# Altium schematic sheet 8bit_reg_v1.SchDoc
size OrCAD E; SheetNumber: 1; SheetTotal: 1
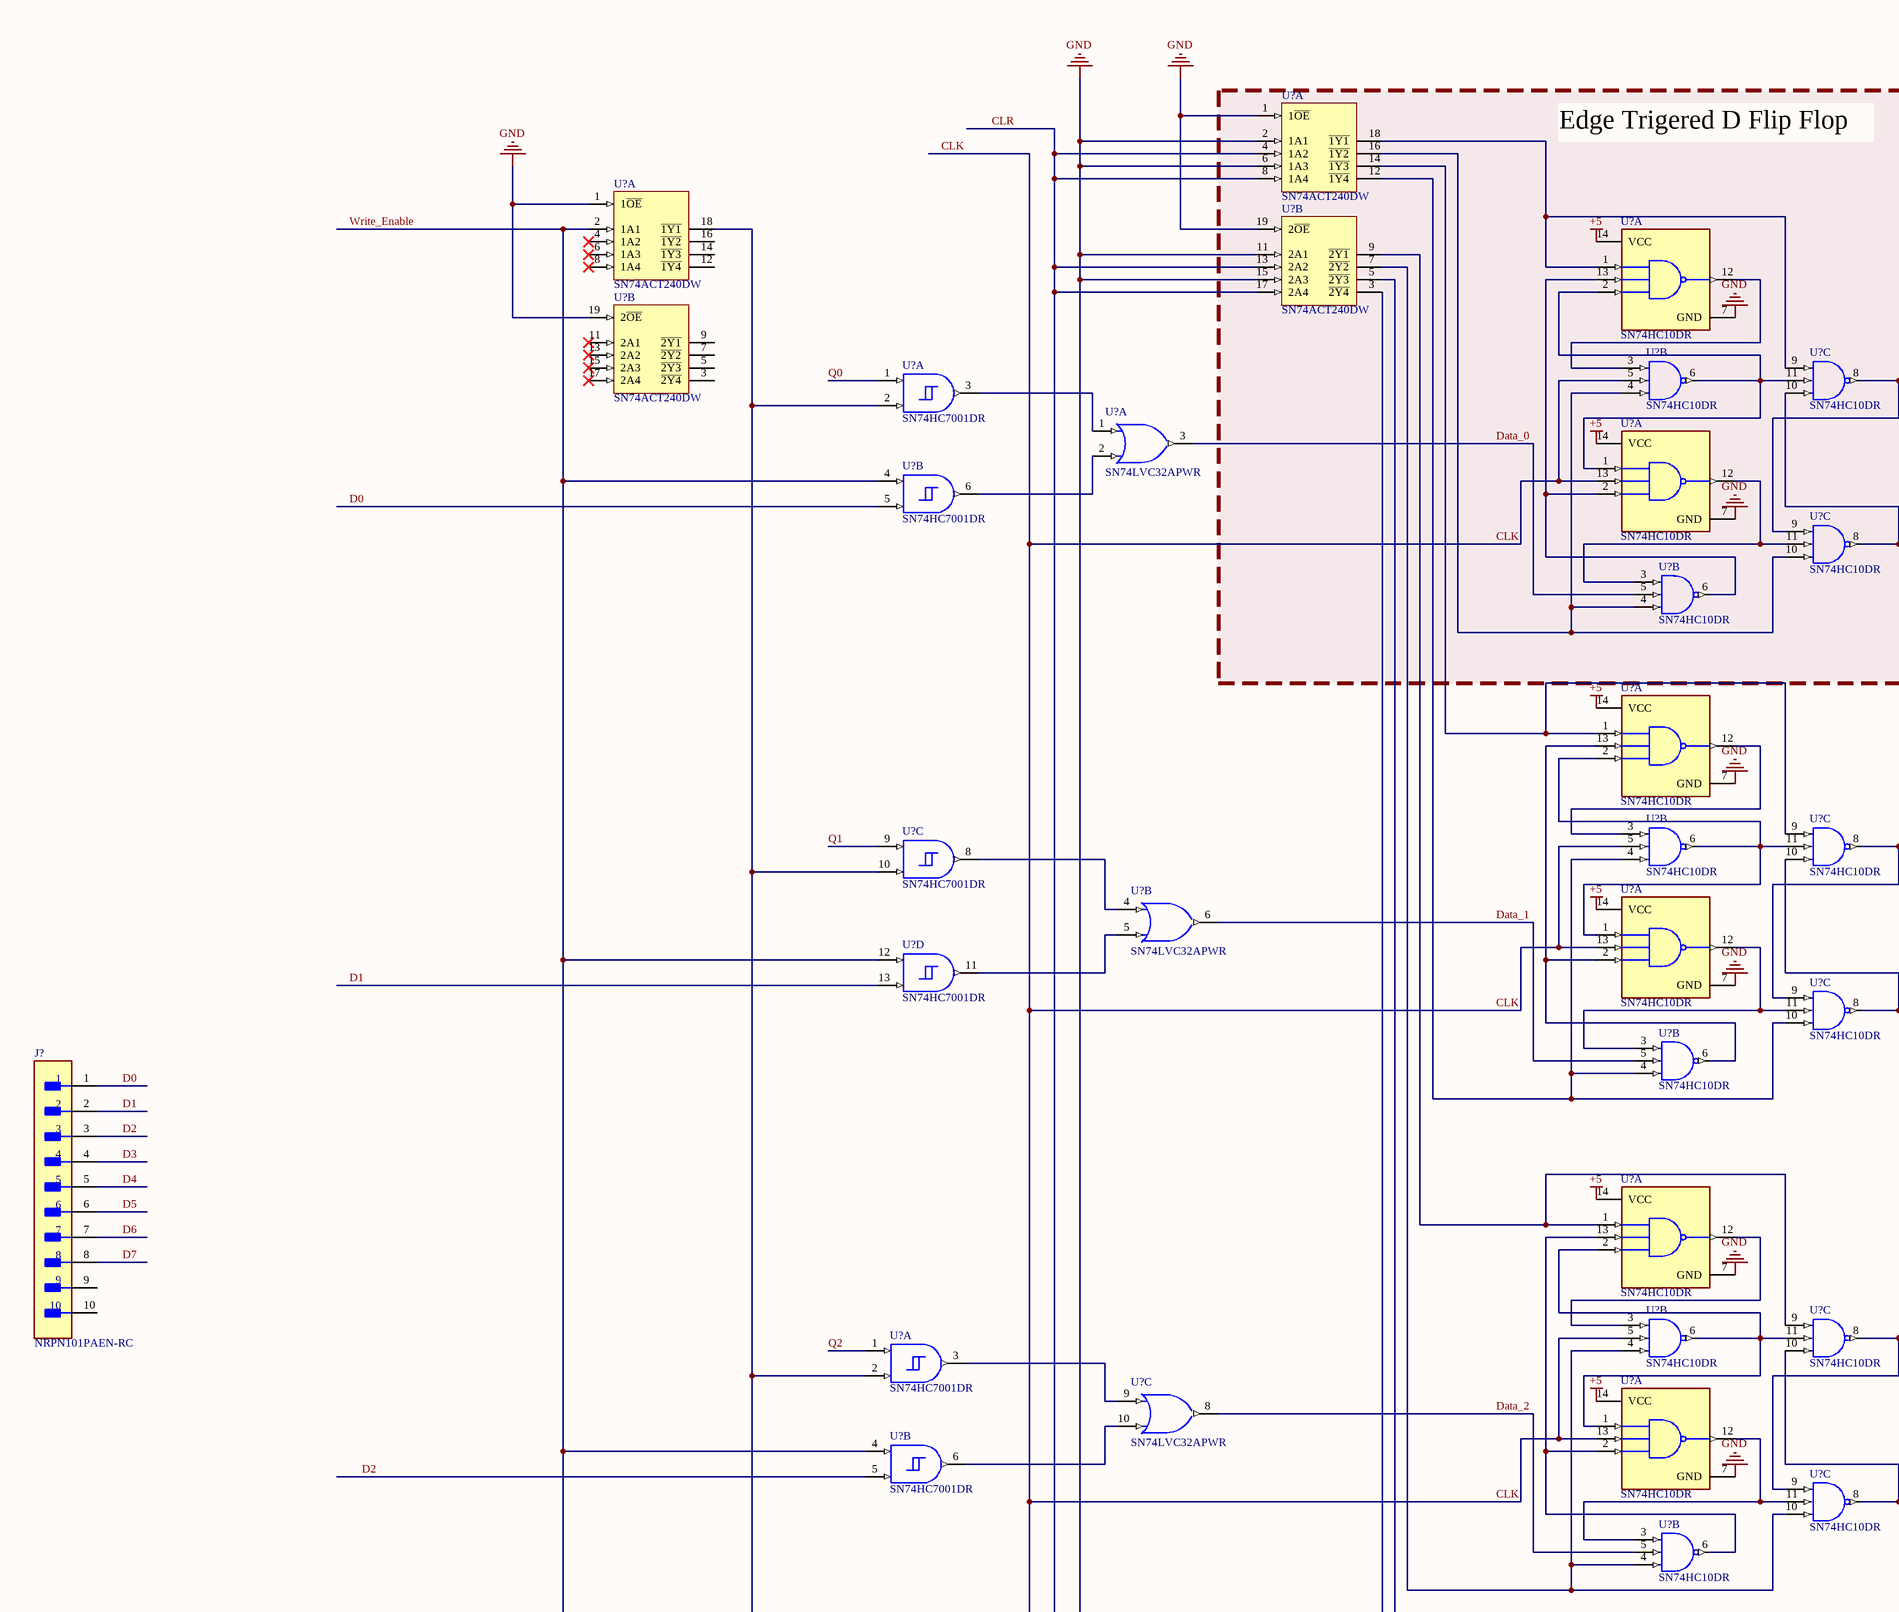
[diagram p0: 8bit_reg_v1.SchDoc, top left]
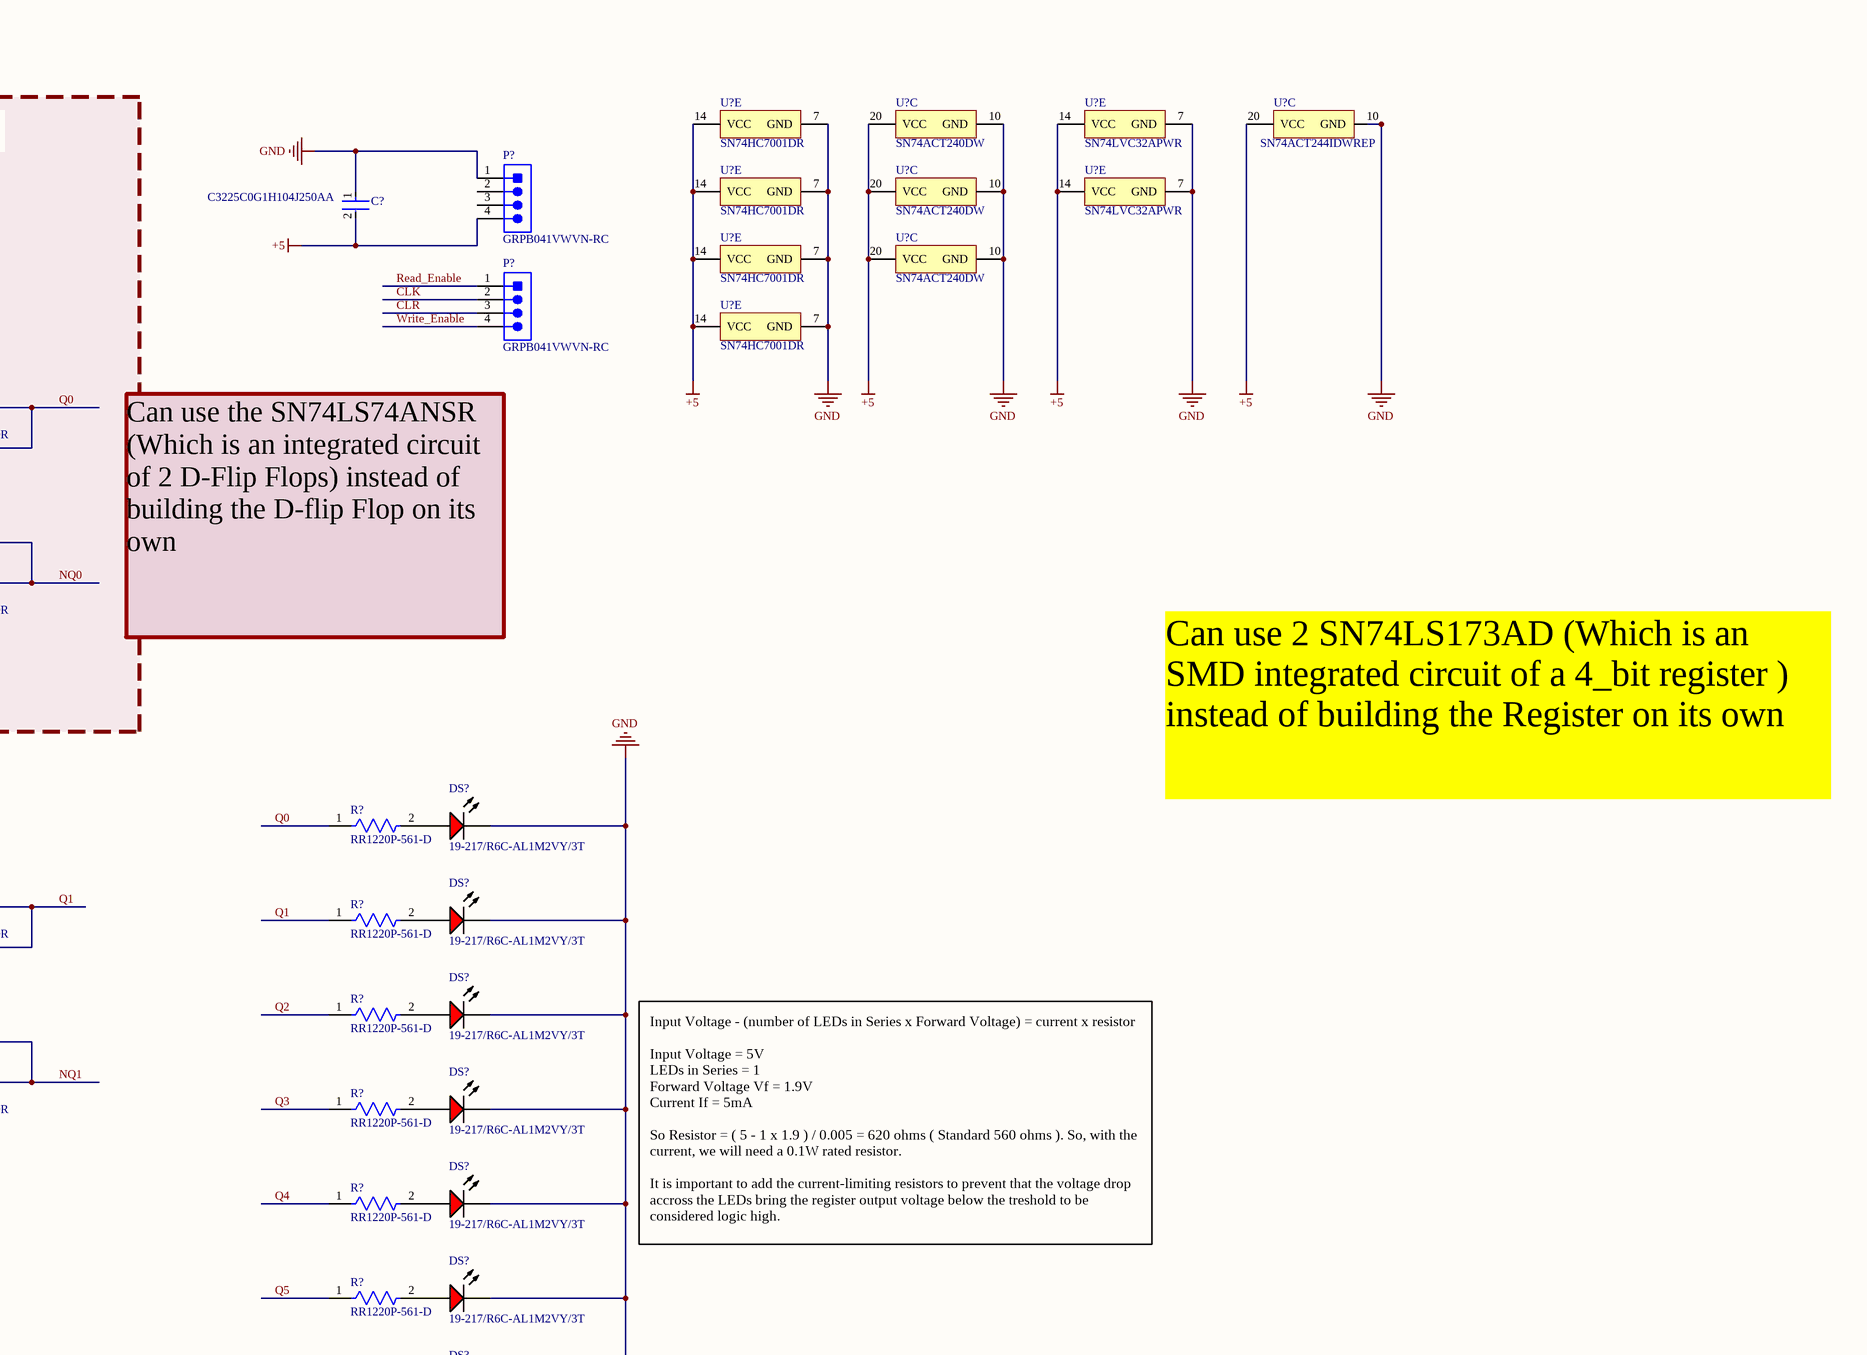
[diagram p1: 8bit_reg_v1.SchDoc, top right]
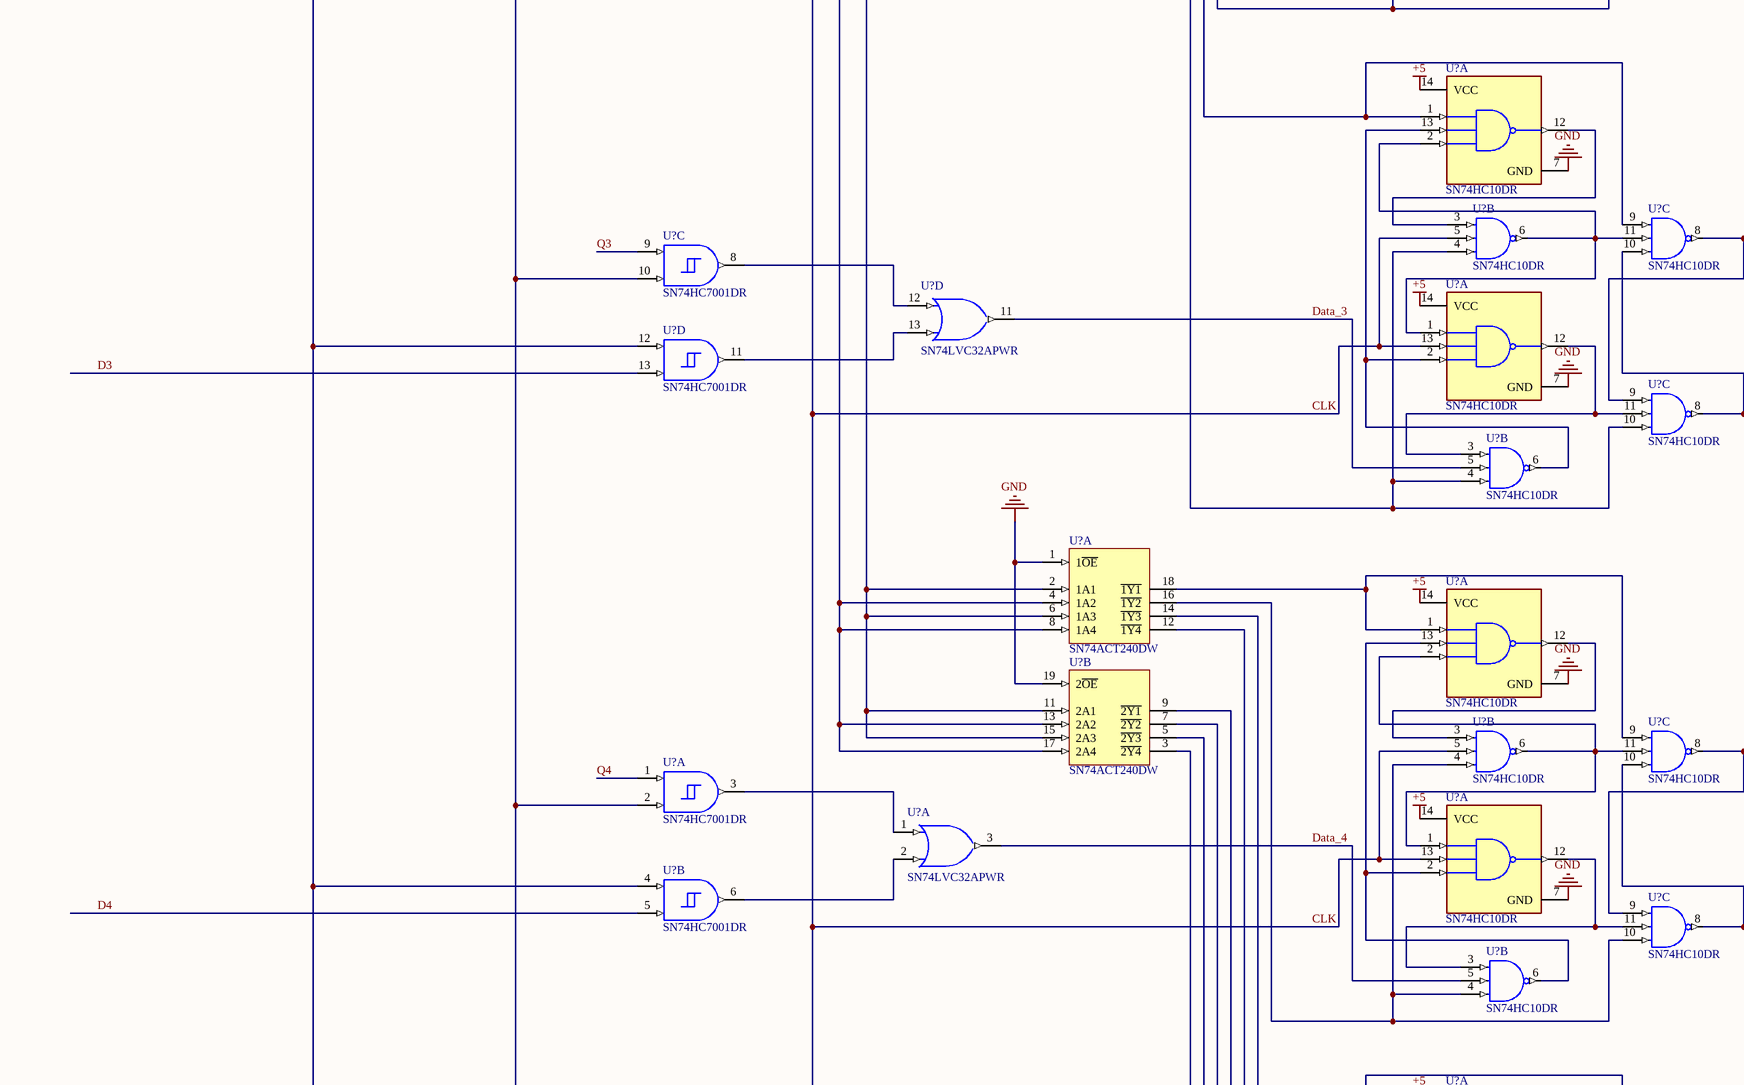
[diagram p2: 8bit_reg_v1.SchDoc, centre left]
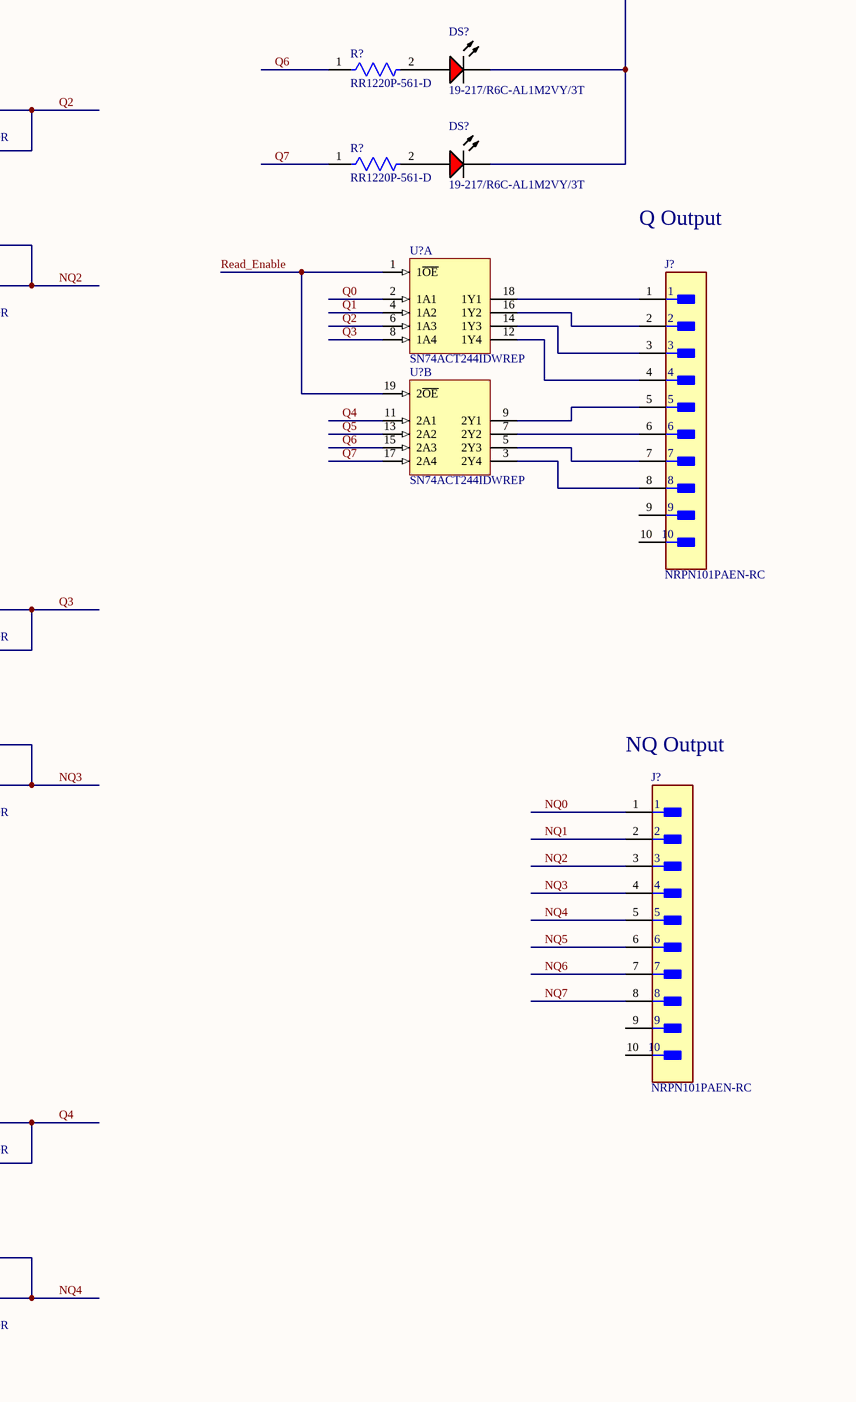
[diagram p3: 8bit_reg_v1.SchDoc, centre right]
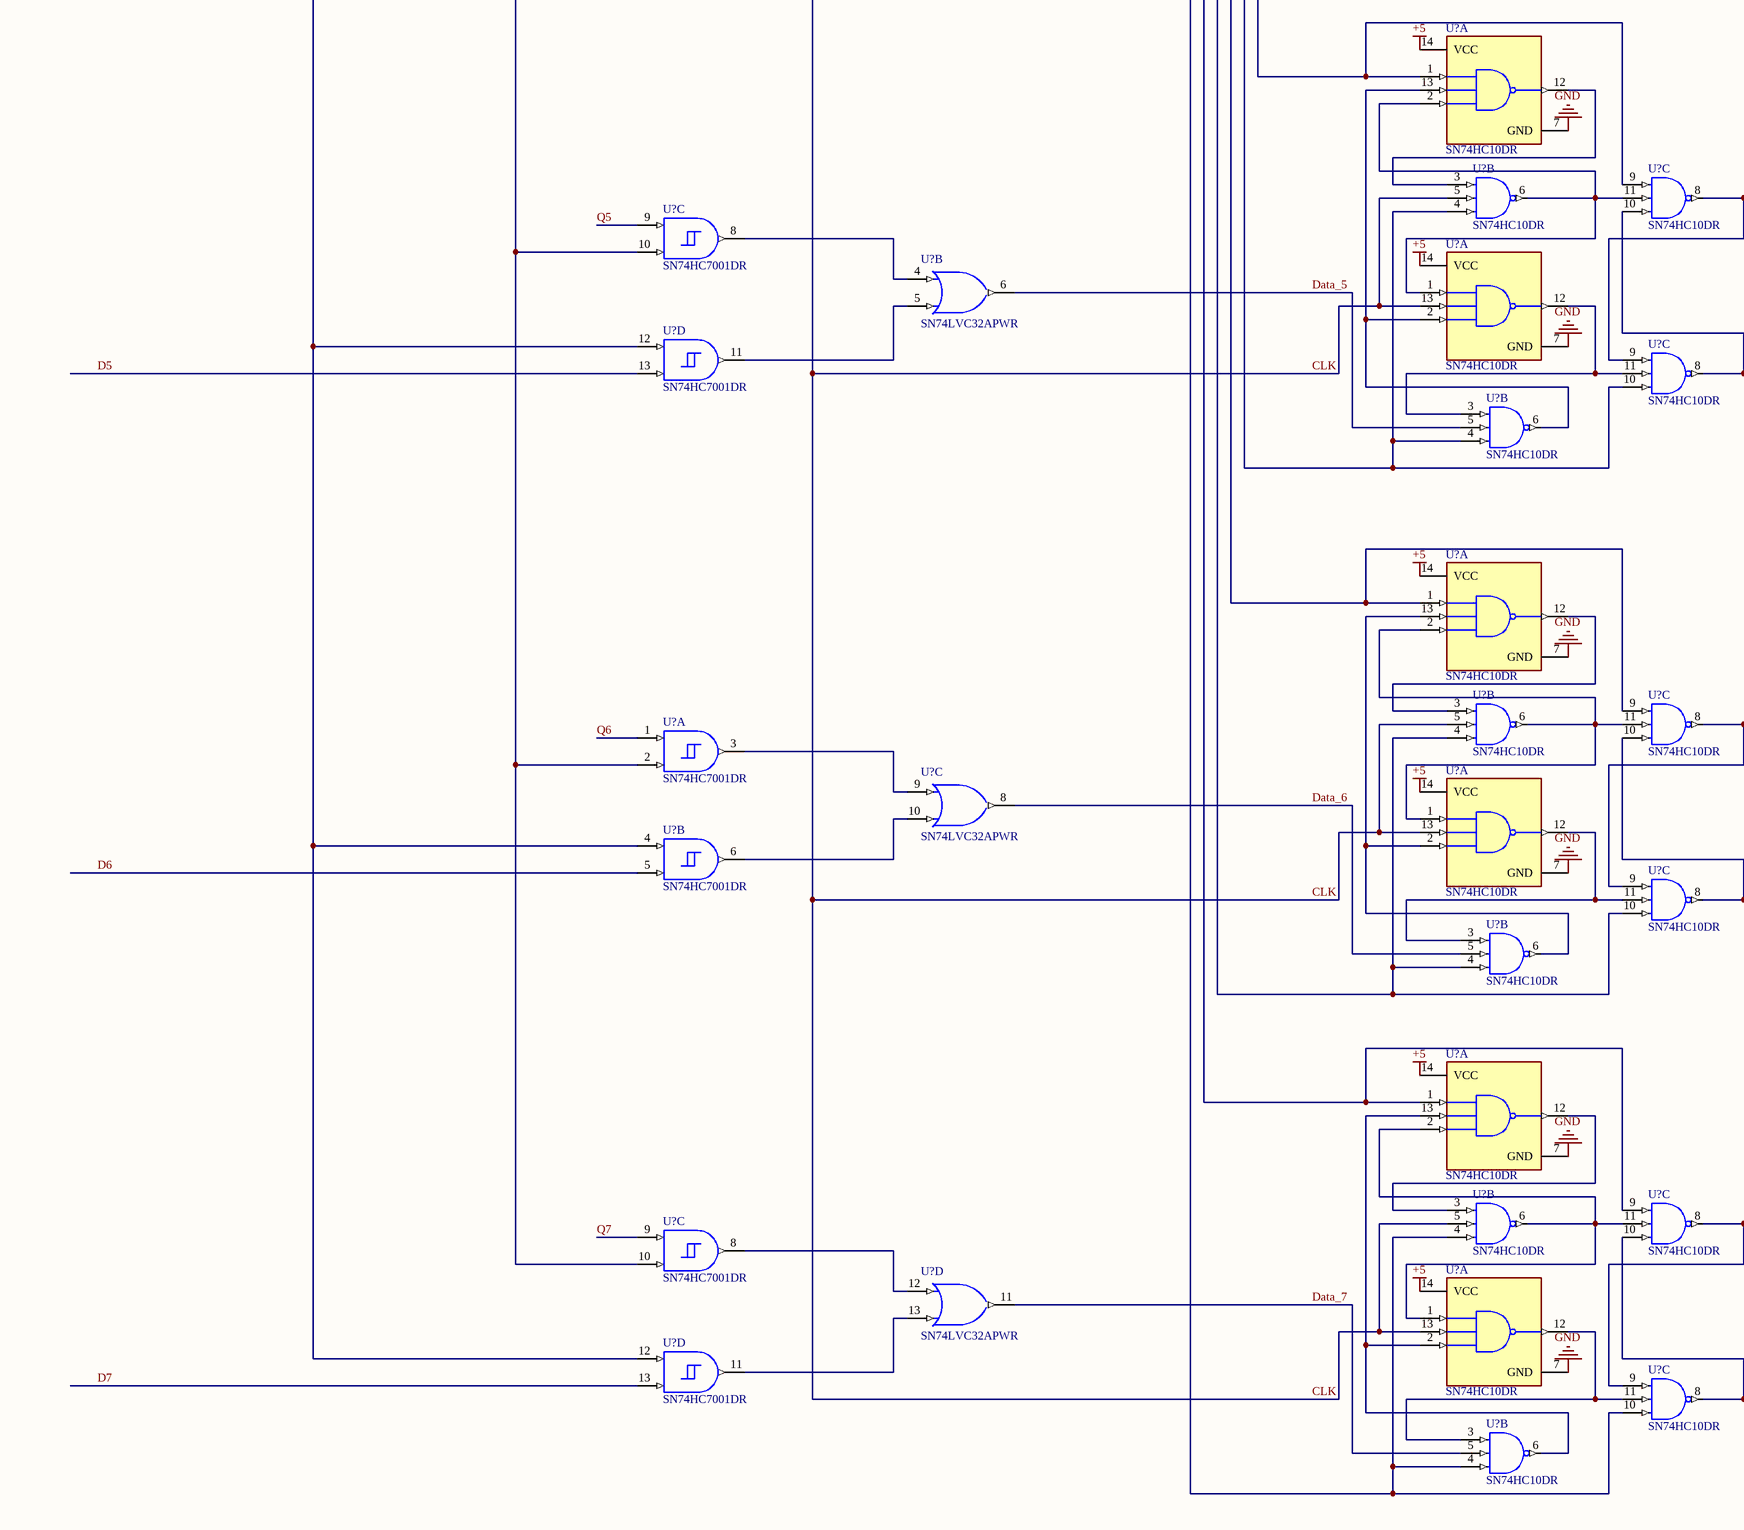
[diagram p4: 8bit_reg_v1.SchDoc, bottom left]
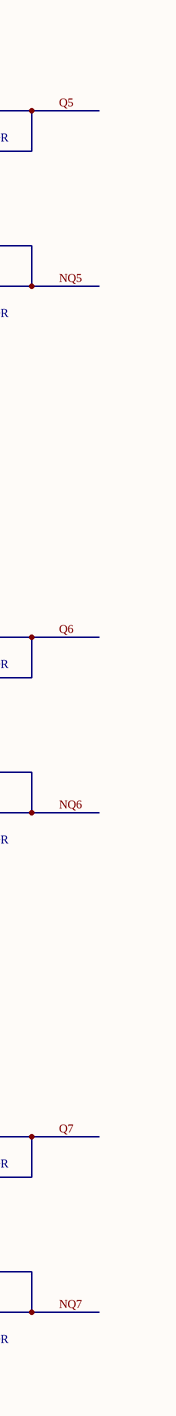
[diagram p5: 8bit_reg_v1.SchDoc, bottom right]

## Parts
(Parts that share a designator on the sheet are numbered #1, #2 ... from top to bottom, then left to right.)
C?  C3225C0G1H104J250AA  [FP-C3225-250-0_4-IPC_A]
DS?#1  19-217/R6C-AL1M2VY/3T  [EVRL-0603-2_V]
DS?#2  19-217/R6C-AL1M2VY/3T  [EVRL-0603-2_V]
DS?#3  19-217/R6C-AL1M2VY/3T  [EVRL-0603-2_V]
DS?#4  19-217/R6C-AL1M2VY/3T  [EVRL-0603-2_V]
DS?#5  19-217/R6C-AL1M2VY/3T  [EVRL-0603-2_V]
DS?#6  19-217/R6C-AL1M2VY/3T  [EVRL-0603-2_V]
DS?#7  19-217/R6C-AL1M2VY/3T  [EVRL-0603-2_V]
DS?#8  19-217/R6C-AL1M2VY/3T  [EVRL-0603-2_V]
J?#1  NRPN101PAEN-RC  [FP-NRPN101PAEN-RC-MFG]
J?#2  NRPN101PAEN-RC  [FP-NRPN101PAEN-RC-MFG]
J?#3  NRPN101PAEN-RC  [FP-NRPN101PAEN-RC-MFG]
P?#1  GRPB041VWVN-RC  [SLIN-GRPB041VWVN-RC_V]
P?#2  GRPB041VWVN-RC  [SLIN-GRPB041VWVN-RC_V]
R?#1  RR1220P-561-D  [FP-RR1220-IPC_C]
R?#2  RR1220P-561-D  [FP-RR1220-IPC_C]
R?#3  RR1220P-561-D  [FP-RR1220-IPC_C]
R?#4  RR1220P-561-D  [FP-RR1220-IPC_C]
R?#5  RR1220P-561-D  [FP-RR1220-IPC_C]
R?#6  RR1220P-561-D  [FP-RR1220-IPC_C]
R?#7  RR1220P-561-D  [FP-RR1220-IPC_C]
R?#8  RR1220P-561-D  [FP-RR1220-IPC_C]
U?#1  SN74ACT240DW  [DW0020A_M]  (part A of 3)
U?#2  SN74HC7001DR  [D0014A_L]  (part E of 5)
U?#3  SN74ACT240DW  [DW0020A_M]  (part C of 3)
U?#4  SN74LVC32APWR  [PW0014A_N]  (part E of 5)
U?#5  SN74ACT244IDWREP  [DW0020A_L]  (part C of 3)
U?#6  SN74HC7001DR  [D0014A_L]  (part E of 5)
U?#7  SN74ACT240DW  [DW0020A_M]  (part C of 3)
U?#8  SN74LVC32APWR  [PW0014A_N]  (part E of 5)
U?#9  SN74ACT240DW  [DW0020A_M]  (part A of 3)
U?#10  SN74ACT240DW  [DW0020A_M]  (part B of 3)
U?#11  SN74HC7001DR  [D0014A_L]  (part E of 5)
U?#12  SN74ACT240DW  [DW0020A_M]  (part C of 3)
U?#13  SN74HC10DR  [FP-D0014A-IPC_B]  (part A of 3)
U?#14  SN74HC7001DR  [D0014A_L]  (part E of 5)
U?#15  SN74ACT240DW  [DW0020A_M]  (part B of 3)
U?#16  SN74HC7001DR  [D0014A_L]  (part A of 5)
U?#17  SN74HC10DR  [FP-D0014A-IPC_B]  (part B of 3)
U?#18  SN74HC10DR  [FP-D0014A-IPC_B]  (part C of 3)
U?#19  SN74LVC32APWR  [PW0014A_N]  (part A of 5)
U?#20  SN74HC10DR  [FP-D0014A-IPC_B]  (part A of 3)
U?#21  SN74HC7001DR  [D0014A_L]  (part B of 5)
U?#22  SN74HC10DR  [FP-D0014A-IPC_B]  (part C of 3)
U?#23  SN74HC10DR  [FP-D0014A-IPC_B]  (part B of 3)
U?#24  SN74HC10DR  [FP-D0014A-IPC_B]  (part A of 3)
U?#25  SN74HC7001DR  [D0014A_L]  (part C of 5)
U?#26  SN74HC10DR  [FP-D0014A-IPC_B]  (part B of 3)
U?#27  SN74HC10DR  [FP-D0014A-IPC_B]  (part C of 3)
U?#28  SN74LVC32APWR  [PW0014A_N]  (part B of 5)
U?#29  SN74HC10DR  [FP-D0014A-IPC_B]  (part A of 3)
U?#30  SN74HC7001DR  [D0014A_L]  (part D of 5)
U?#31  SN74HC10DR  [FP-D0014A-IPC_B]  (part C of 3)
U?#32  SN74HC10DR  [FP-D0014A-IPC_B]  (part B of 3)
U?#33  SN74HC10DR  [FP-D0014A-IPC_B]  (part A of 3)
U?#34  SN74HC10DR  [FP-D0014A-IPC_B]  (part B of 3)
U?#35  SN74HC10DR  [FP-D0014A-IPC_B]  (part C of 3)
U?#36  SN74HC7001DR  [D0014A_L]  (part A of 5)
U?#37  SN74LVC32APWR  [PW0014A_N]  (part C of 5)
U?#38  SN74HC10DR  [FP-D0014A-IPC_B]  (part A of 3)
U?#39  SN74HC7001DR  [D0014A_L]  (part B of 5)
U?#40  SN74ACT244IDWREP  [DW0020A_L]  (part A of 3)
U?#41  SN74HC10DR  [FP-D0014A-IPC_B]  (part C of 3)
U?#42  SN74HC10DR  [FP-D0014A-IPC_B]  (part B of 3)
U?#43  SN74ACT244IDWREP  [DW0020A_L]  (part B of 3)
U?#44  SN74HC10DR  [FP-D0014A-IPC_B]  (part A of 3)
U?#45  SN74HC10DR  [FP-D0014A-IPC_B]  (part B of 3)
U?#46  SN74HC10DR  [FP-D0014A-IPC_B]  (part C of 3)
U?#47  SN74HC7001DR  [D0014A_L]  (part C of 5)
U?#48  SN74LVC32APWR  [PW0014A_N]  (part D of 5)
U?#49  SN74HC10DR  [FP-D0014A-IPC_B]  (part A of 3)
U?#50  SN74HC7001DR  [D0014A_L]  (part D of 5)
U?#51  SN74HC10DR  [FP-D0014A-IPC_B]  (part C of 3)
U?#52  SN74HC10DR  [FP-D0014A-IPC_B]  (part B of 3)
U?#53  SN74ACT240DW  [DW0020A_M]  (part A of 3)
U?#54  SN74HC10DR  [FP-D0014A-IPC_B]  (part A of 3)
U?#55  SN74ACT240DW  [DW0020A_M]  (part B of 3)
U?#56  SN74HC10DR  [FP-D0014A-IPC_B]  (part B of 3)
U?#57  SN74HC10DR  [FP-D0014A-IPC_B]  (part C of 3)
U?#58  SN74HC7001DR  [D0014A_L]  (part A of 5)
U?#59  SN74LVC32APWR  [PW0014A_N]  (part A of 5)
U?#60  SN74HC10DR  [FP-D0014A-IPC_B]  (part A of 3)
U?#61  SN74HC7001DR  [D0014A_L]  (part B of 5)
U?#62  SN74HC10DR  [FP-D0014A-IPC_B]  (part C of 3)
U?#63  SN74HC10DR  [FP-D0014A-IPC_B]  (part B of 3)
U?#64  SN74HC10DR  [FP-D0014A-IPC_B]  (part A of 3)
U?#65  SN74HC10DR  [FP-D0014A-IPC_B]  (part B of 3)
U?#66  SN74HC10DR  [FP-D0014A-IPC_B]  (part C of 3)
U?#67  SN74HC7001DR  [D0014A_L]  (part C of 5)
U?#68  SN74LVC32APWR  [PW0014A_N]  (part B of 5)
U?#69  SN74HC10DR  [FP-D0014A-IPC_B]  (part A of 3)
U?#70  SN74HC7001DR  [D0014A_L]  (part D of 5)
U?#71  SN74HC10DR  [FP-D0014A-IPC_B]  (part C of 3)
U?#72  SN74HC10DR  [FP-D0014A-IPC_B]  (part B of 3)
U?#73  SN74HC10DR  [FP-D0014A-IPC_B]  (part A of 3)
U?#74  SN74HC10DR  [FP-D0014A-IPC_B]  (part B of 3)
U?#75  SN74HC10DR  [FP-D0014A-IPC_B]  (part C of 3)
U?#76  SN74HC7001DR  [D0014A_L]  (part A of 5)
U?#77  SN74LVC32APWR  [PW0014A_N]  (part C of 5)
U?#78  SN74HC10DR  [FP-D0014A-IPC_B]  (part A of 3)
U?#79  SN74HC7001DR  [D0014A_L]  (part B of 5)
U?#80  SN74HC10DR  [FP-D0014A-IPC_B]  (part C of 3)
U?#81  SN74HC10DR  [FP-D0014A-IPC_B]  (part B of 3)
U?#82  SN74HC10DR  [FP-D0014A-IPC_B]  (part A of 3)
U?#83  SN74HC10DR  [FP-D0014A-IPC_B]  (part B of 3)
U?#84  SN74HC10DR  [FP-D0014A-IPC_B]  (part C of 3)
U?#85  SN74HC7001DR  [D0014A_L]  (part C of 5)
U?#86  SN74LVC32APWR  [PW0014A_N]  (part D of 5)
U?#87  SN74HC10DR  [FP-D0014A-IPC_B]  (part A of 3)
U?#88  SN74HC7001DR  [D0014A_L]  (part D of 5)
U?#89  SN74HC10DR  [FP-D0014A-IPC_B]  (part C of 3)
U?#90  SN74HC10DR  [FP-D0014A-IPC_B]  (part B of 3)

## Nets
+5: C?.2 P?#1.4 U?#2.14(VCC) U?#3.20(VCC) U?#4.14(VCC) U?#5.20(VCC) U?#6.14(VCC) U?#7.20(VCC) U?#8.14(VCC) U?#11.14(VCC) U?#12.20(VCC) U?#13.14(VCC) U?#14.14(VCC) U?#20.14(VCC) U?#24.14(VCC) U?#29.14(VCC) U?#33.14(VCC) U?#38.14(VCC) U?#44.14(VCC) U?#49.14(VCC) U?#54.14(VCC) U?#60.14(VCC) U?#64.14(VCC) U?#69.14(VCC) U?#73.14(VCC) U?#78.14(VCC) U?#82.14(VCC) U?#87.14(VCC)
GND: C?.1 DS?#1.2(K) DS?#2.2(K) DS?#3.2(K) DS?#4.2(K) DS?#5.2(K) DS?#6.2(K) DS?#7.2(K) DS?#8.2(K) P?#1.1 U?#1.1(1~{OE}) U?#1.2(1A1) U?#1.6(1A3) U?#2.7(GND) U?#3.10(GND) U?#4.7(GND) U?#5.10(GND) U?#6.7(GND) U?#7.10(GND) U?#8.7(GND) U?#9.1(1~{OE}) U?#10.11(2A1) U?#10.15(2A3) U?#10.19(2~{OE}) U?#11.7(GND) U?#12.10(GND) U?#13.7(GND) U?#14.7(GND) U?#15.19(2~{OE}) U?#20.7(GND) U?#24.7(GND) U?#29.7(GND) U?#33.7(GND) U?#38.7(GND) U?#44.7(GND) U?#49.7(GND) U?#53.1(1~{OE}) U?#53.2(1A1) U?#53.6(1A3) U?#54.7(GND) U?#55.11(2A1) U?#55.15(2A3) U?#55.19(2~{OE}) U?#60.7(GND) U?#64.7(GND) U?#69.7(GND) U?#73.7(GND) U?#78.7(GND) U?#82.7(GND) U?#87.7(GND)
CLK: P?#2.2 U?#17.5(2C) U?#20.13(1C) U?#26.5(2C) U?#29.13(1C) U?#34.5(2C) U?#38.13(1C) U?#45.5(2C) U?#49.13(1C) U?#56.5(2C) U?#60.13(1C) U?#65.5(2C) U?#69.13(1C) U?#74.5(2C) U?#78.13(1C) U?#83.5(2C) U?#87.13(1C)
CLR: P?#2.3 U?#1.4(1A2) U?#1.8(1A4) U?#10.13(2A2) U?#10.17(2A4) U?#53.4(1A2) U?#53.8(1A4) U?#55.13(2A2) U?#55.17(2A4)
D0: J?#1.1 U?#21.5(2B)
D1: J?#1.2 U?#30.13(4B)
D2: J?#1.3 U?#39.5(2B)
D3: J?#1.4 U?#50.13(4B)
D4: J?#1.5 U?#61.5(2B)
D5: J?#1.6 U?#70.13(4B)
D6: J?#1.7 U?#79.5(2B)
D7: J?#1.8 U?#88.13(4B)
Data_0: U?#19.3(1Y) U?#23.5(2C)
Data_1: U?#28.6(2Y) U?#32.5(2C)
Data_2: U?#37.8(3Y) U?#42.5(2C)
Data_3: U?#48.11(4Y) U?#52.5(2C)
Data_4: U?#59.3(1Y) U?#63.5(2C)
Data_5: U?#68.6(2Y) U?#72.5(2C)
Data_6: U?#77.8(3Y) U?#81.5(2C)
Data_7: U?#86.11(4Y) U?#90.5(2C)
NQ0: J?#3.1 U?#18.10(3B) U?#22.8(3Y)
NQ1: J?#3.2 U?#27.10(3B) U?#31.8(3Y)
NQ2: J?#3.3 U?#35.10(3B) U?#41.8(3Y)
NQ3: J?#3.4 U?#46.10(3B) U?#51.8(3Y)
NQ4: J?#3.5 U?#57.10(3B) U?#62.8(3Y)
NQ5: J?#3.6 U?#66.10(3B) U?#71.8(3Y)
NQ6: J?#3.7 U?#75.10(3B) U?#80.8(3Y)
NQ7: J?#3.8 U?#84.10(3B) U?#89.8(3Y)
Q0: R?#1.1 U?#16.1(1A) U?#18.8(3Y) U?#22.9(3A) U?#40.2(1A1)
Q1: R?#2.1 U?#25.9(3A) U?#27.8(3Y) U?#31.9(3A) U?#40.4(1A2)
Q2: R?#3.1 U?#35.8(3Y) U?#36.1(1A) U?#40.6(1A3) U?#41.9(3A)
Q3: R?#4.1 U?#40.8(1A4) U?#46.8(3Y) U?#47.9(3A) U?#51.9(3A)
Q4: R?#5.1 U?#43.11(2A1) U?#57.8(3Y) U?#58.1(1A) U?#62.9(3A)
Q5: R?#6.1 U?#43.13(2A2) U?#66.8(3Y) U?#67.9(3A) U?#71.9(3A)
Q6: R?#7.1 U?#43.15(2A3) U?#75.8(3Y) U?#76.1(1A) U?#80.9(3A)
Q7: R?#8.1 U?#43.17(2A4) U?#84.8(3Y) U?#85.9(3A) U?#89.9(3A)
Read_Enable: P?#2.1 U?#40.1(1~{OE}) U?#43.19(2~{OE})
Write_Enable: P?#2.4 U?#9.2(1A1) U?#21.4(2A) U?#30.12(4A) U?#39.4(2A) U?#50.12(4A) U?#61.4(2A) U?#70.12(4A) U?#79.4(2A) U?#88.12(4A)
NetDS?#1_1: DS?#1.1(A) R?#1.2
NetDS?#2_1: DS?#2.1(A) R?#2.2
NetDS?#3_1: DS?#3.1(A) R?#3.2
NetDS?#4_1: DS?#4.1(A) R?#4.2
NetDS?#5_1: DS?#5.1(A) R?#5.2
NetDS?#6_1: DS?#6.1(A) R?#6.2
NetDS?#7_1: DS?#7.1(A) R?#7.2
NetDS?#8_1: DS?#8.1(A) R?#8.2
NetJ?#2_1: J?#2.1 U?#40.18(1Y1)
NetJ?#2_2: J?#2.2 U?#40.16(1Y2)
NetJ?#2_3: J?#2.3 U?#40.14(1Y3)
NetJ?#2_4: J?#2.4 U?#40.12(1Y4)
NetJ?#2_5: J?#2.5 U?#43.9(2Y1)
NetJ?#2_6: J?#2.6 U?#43.7(2Y2)
NetJ?#2_7: J?#2.7 U?#43.5(2Y3)
NetJ?#2_8: J?#2.8 U?#43.3(2Y4)
NetU?#1_12: U?#1.12(~{1Y4}) U?#26.4(2B) U?#31.10(3B) U?#32.4(2B)
NetU?#1_14: U?#1.14(~{1Y3}) U?#24.1(1A) U?#27.9(3A)
NetU?#1_16: U?#1.16(~{1Y2}) U?#17.4(2B) U?#22.10(3B) U?#23.4(2B)
NetU?#1_18: U?#1.18(~{1Y1}) U?#13.1(1A) U?#18.9(3A)
NetU?#9_18: U?#9.18(~{1Y1}) U?#16.2(1B) U?#25.10(3B) U?#36.2(1B) U?#47.10(3B) U?#58.2(1B) U?#67.10(3B) U?#76.2(1B) U?#85.10(3B)
NetU?#10_3: U?#10.3(~{2Y4}) U?#45.4(2B) U?#51.10(3B) U?#52.4(2B)
NetU?#10_5: U?#10.5(~{2Y3}) U?#44.1(1A) U?#46.9(3A)
NetU?#10_7: U?#10.7(~{2Y2}) U?#34.4(2B) U?#41.10(3B) U?#42.4(2B)
NetU?#10_9: U?#10.9(~{2Y1}) U?#33.1(1A) U?#35.9(3A)
NetU?#13_2: U?#13.2(1B) U?#17.6(2Y) U?#18.11(3C) U?#20.1(1A)
NetU?#13_12: U?#13.12(1Y) U?#17.3(2A)
NetU?#13_13: U?#13.13(1C) U?#20.2(1B) U?#23.6(2Y)
NetU?#16_3: U?#16.3(1Y) U?#19.1(1A)
NetU?#19_2: U?#19.2(1B) U?#21.6(2Y)
NetU?#20_12: U?#20.12(1Y) U?#22.11(3C) U?#23.3(2A)
NetU?#24_2: U?#24.2(1B) U?#26.6(2Y) U?#27.11(3C) U?#29.1(1A)
NetU?#24_12: U?#24.12(1Y) U?#26.3(2A)
NetU?#24_13: U?#24.13(1C) U?#29.2(1B) U?#32.6(2Y)
NetU?#25_8: U?#25.8(3Y) U?#28.4(2A)
NetU?#28_5: U?#28.5(2B) U?#30.11(4Y)
NetU?#29_12: U?#29.12(1Y) U?#31.11(3C) U?#32.3(2A)
NetU?#33_2: U?#33.2(1B) U?#34.6(2Y) U?#35.11(3C) U?#38.1(1A)
NetU?#33_12: U?#33.12(1Y) U?#34.3(2A)
NetU?#33_13: U?#33.13(1C) U?#38.2(1B) U?#42.6(2Y)
NetU?#36_3: U?#36.3(1Y) U?#37.9(3A)
NetU?#37_10: U?#37.10(3B) U?#39.6(2Y)
NetU?#38_12: U?#38.12(1Y) U?#41.11(3C) U?#42.3(2A)
NetU?#44_2: U?#44.2(1B) U?#45.6(2Y) U?#46.11(3C) U?#49.1(1A)
NetU?#44_12: U?#44.12(1Y) U?#45.3(2A)
NetU?#44_13: U?#44.13(1C) U?#49.2(1B) U?#52.6(2Y)
NetU?#47_8: U?#47.8(3Y) U?#48.12(4A)
NetU?#48_13: U?#48.13(4B) U?#50.11(4Y)
NetU?#49_12: U?#49.12(1Y) U?#51.11(3C) U?#52.3(2A)
NetU?#53_12: U?#53.12(~{1Y4}) U?#65.4(2B) U?#71.10(3B) U?#72.4(2B)
NetU?#53_14: U?#53.14(~{1Y3}) U?#64.1(1A) U?#66.9(3A)
NetU?#53_16: U?#53.16(~{1Y2}) U?#56.4(2B) U?#62.10(3B) U?#63.4(2B)
NetU?#53_18: U?#53.18(~{1Y1}) U?#54.1(1A) U?#57.9(3A)
NetU?#54_2: U?#54.2(1B) U?#56.6(2Y) U?#57.11(3C) U?#60.1(1A)
NetU?#54_12: U?#54.12(1Y) U?#56.3(2A)
NetU?#54_13: U?#54.13(1C) U?#60.2(1B) U?#63.6(2Y)
NetU?#55_3: U?#55.3(~{2Y4}) U?#83.4(2B) U?#89.10(3B) U?#90.4(2B)
NetU?#55_5: U?#55.5(~{2Y3}) U?#82.1(1A) U?#84.9(3A)
NetU?#55_7: U?#55.7(~{2Y2}) U?#74.4(2B) U?#80.10(3B) U?#81.4(2B)
NetU?#55_9: U?#55.9(~{2Y1}) U?#73.1(1A) U?#75.9(3A)
NetU?#58_3: U?#58.3(1Y) U?#59.1(1A)
NetU?#59_2: U?#59.2(1B) U?#61.6(2Y)
NetU?#60_12: U?#60.12(1Y) U?#62.11(3C) U?#63.3(2A)
NetU?#64_2: U?#64.2(1B) U?#65.6(2Y) U?#66.11(3C) U?#69.1(1A)
NetU?#64_12: U?#64.12(1Y) U?#65.3(2A)
NetU?#64_13: U?#64.13(1C) U?#69.2(1B) U?#72.6(2Y)
NetU?#67_8: U?#67.8(3Y) U?#68.4(2A)
NetU?#68_5: U?#68.5(2B) U?#70.11(4Y)
NetU?#69_12: U?#69.12(1Y) U?#71.11(3C) U?#72.3(2A)
NetU?#73_2: U?#73.2(1B) U?#74.6(2Y) U?#75.11(3C) U?#78.1(1A)
NetU?#73_12: U?#73.12(1Y) U?#74.3(2A)
NetU?#73_13: U?#73.13(1C) U?#78.2(1B) U?#81.6(2Y)
NetU?#76_3: U?#76.3(1Y) U?#77.9(3A)
NetU?#77_10: U?#77.10(3B) U?#79.6(2Y)
NetU?#78_12: U?#78.12(1Y) U?#80.11(3C) U?#81.3(2A)
NetU?#82_2: U?#82.2(1B) U?#83.6(2Y) U?#84.11(3C) U?#87.1(1A)
NetU?#82_12: U?#82.12(1Y) U?#83.3(2A)
NetU?#82_13: U?#82.13(1C) U?#87.2(1B) U?#90.6(2Y)
NetU?#85_8: U?#85.8(3Y) U?#86.12(4A)
NetU?#86_13: U?#86.13(4B) U?#88.11(4Y)
NetU?#87_12: U?#87.12(1Y) U?#89.11(3C) U?#90.3(2A)

Not connected (* = marked no-connect by the designer): J?#1 9 10; J?#2 9 10; J?#3 9 10; P?#1 2 3; U?#9 4(1A2)* 6(1A3)* 8(1A4)* 12(~{1Y4}) 14(~{1Y3}) 16(~{1Y2}); U?#15 3(~{2Y4}) 5(~{2Y3}) 7(~{2Y2}) 9(~{2Y1}) 11(2A1)* 13(2A2)* 15(2A3)* 17(2A4)*

## Notes on the sheet
- Edge Trigered D Flip Flop
- Can use the SN74LS74ANSR (Which is an integrated circuit of 2 D-Flip Flops) instead of building the D-flip Flop on its own
- Can use 2 SN74LS173AD (Which is an SMD integrated circuit of a 4_bit register ) instead of building the Register on its own
- Input Voltage - (number of LEDs in Series x Forward Voltage) = current x resistor
  Input Voltage = 5V
  LEDs in Series = 1
  Forward Voltage Vf = 1.9V
  Current If = 5mA
  So Resistor = ( 5 - 1 x 1.9 ) / 0.005 = 620 ohms ( Standard 560 ohms ). So, with the current, we will need a 0.1W rated resistor.
  It is important to add the current-limiting resistors to prevent that the voltage drop accross the LEDs bring the register output voltage below the treshold to be considered logic high.
- Q Output
- NQ Output

## Library data of the parts
C? = CMP-08246-002678-1: CAP CER 0.1UF 50V C0G 1210; Tolerance: 5%; Dielectric Material: Ceramic; Capacitance: 100nF; Temperature Coefficient: 30ppm/°C; Lead Free: Lead Free; Package Quantity: 1; Series: C; Depth: 2.5mm; Voltage Rating: 50V; Max Operating Temperature: 125°C; Case Code (Metric): 3225; REACH SVHC: No SVHC; Construction: Flat; Case Code (Imperial): 1210; Voltage: 50V; RoHS Compliant: Yes; Packaging: Tape and Reel; Dielectric: C0G; Height: 2.5mm; Termination: SMD/SMT; Length: 3.2mm; Mount: Surface Mount; Width: 0.098inch; Radiation Hardening: No; Thickness: 0.11inch; Min Operating Temperature: -55°C; Voltage Rating (DC): 50V; Weight: 0.000564oz; Case/Package: 1210
DS?#1-DS?#8 = CMP-007-00004-2: Chip LED, Red, 5 V, 25 mA, -40 to 85 degC, 2-Pin SMD (0603), RoHS, Tape and Reel; Manufacturer: Everlight Electronics; Forward Voltage: 2.2V; Lens Style: Clear; Package Reference: 0603; Datasheet Version: Rev. 1, 01/2005; Mounting Technology: SM; RoHS Compliant: False; Datasheet URL: https://datasheet.ciiva.com/4688/el-19-217-r6c-al1m2vy-3tpdf-187026-4688713.pdf; Case/Package: 0603; Colour: Red; Manufacturer URL: http://www.everlight.com/; Package Description: 2-Pin Surface Mount Device, Body 1.6 x 0.8 mm
J?#1-J?#3 = CMP-25680-000006-1: CONN HEADER VERT 10POS 2MM; Manufacturer: Sullins; Current Rating: 2A; Conn Gender: Male; Voltage Rating: 150V; Conn Orientation: Straight; Number Of Contacts: 10; Temperature: -40°C to +105°C; Manufacturer Part Number: NRPN101PAEN-RC; Package: 0; Lead Free: Yes; Device Class L3: unset; Octopart: https://octopart.com/nrpn101paen-rc-sullins-18674398; Device Class L1: Connectors; Contact Material: Gold,Nickel; ComponentLink2URL: https://s3.amazonaws.com/catalogspreads-pdf/PAGE104-105%202mm%20MALE%20HDR%20ST%20RA%20SMT.pdf; Footprint Url: https://drawings-pdf.s3.amazonaws.com/10531.pdf; Height: 5.95mm; Digikey Description: CONN HEADER VERT 10POS 2MM; Category: Conn; Automotive: No; Number Of Rows: 1; Device Class L2: Headers and Wire Housings; Temperature Range High: +105°C; Temperature Range Low: -40°C; Pitch: 2mm; RoHS: TRUE; ComponentLink2Description: Datasheet
P?#1 P?#2 = CMP-2000-06373-1: Male Header, Pitch 1.27 mm, 1 x 4 Position, Height 4 mm, Tail Length 2.3 mm, -40 to 105 degC, RoHS, Bulk; Manufacturer: Sullins; Mating Products: S9010E-04-ND / -CONNHEADER.050"4POSR/APCB / S9008E-04-ND / -CONNHEADER.050"4POSPCBGOLD / S9005E-04-ND / -CONNHEADER.050"4POSSMDGOLD; Other Names: S9014E-04; Dynamic Catalog: GRPB; Pitch: 0.050"(1.27mm); Number of Positions Loaded: All; Number of Positions: 4; Catalog Drawings: S9014ESeriesTop; Connector Type: Header,Unshrouded; Contact Finish Thickness: Flash; Number of Rows: 1; Contact Type: MalePin; Category: Connectors,Interconnects; Contact Mating Length: 0.118"(3.00mm); Family: RectangularConnectors-Headers,MalePins; Datasheet Version: Rev. C, 12/2008; Contact Finish: Gold; Termination: Solder; Manufacturer URL: http://www.sullinscorp.com/; Mounting Type: ThroughHole; Packaging: Bulk; Package Reference: GRPB041VWVN-RC; Datasheet URL: http://www.sullinscorp.com/drawings/71_GRPB___1VWVN-RC,_10957-C.pdf; Mounting Technology: ThroughHole; Package Description: Male Header, Pitch 1.27 mm, 1 x 4 Position, Height 4 mm, Tail Length 2.3 mm; Standard Package: 1
R?#1-R?#8 = CMP-2001-03458-2: 560Ω ±0.5% 0.1W 1/10W Chip Resistor 0805 (2012 Metric) Thin Film; Max Power Dissipation: 100mW; Voltage Rating (DC): 100V; Resistance: 560R; Temperature Coefficient: 25ppm/°C; Height: 0.4mm; Number of Pins: 2; Case Code (Imperial): 0805; Lead Free: Lead Free; Max Operating Temperature: 125°C; Tolerance: 0.5%; Case/Package: 0805; Technology: THIN FILM; Series: RR; Voltage Rating: 100V; Mount: Surface Mount; Depth: 1.25mm; Number of Terminations: 2; Length: 2mm; Power Rating: 100mW; Package Quantity: 1; Size Code: 0805; Termination: SMD/SMT; Case Code (Metric): 2012; Width: 0.049inch; RoHS Compliant: Yes; Packaging: Tape and Reel; Min Operating Temperature: -55°C; Resistor Type: Thin Film
U?#1 U?#3 U?#7 U?#9 U?#10 U?#12 U?#15 U?#53 U?#55 = CMP-016-00012-1: Buffer/Line Driver 8-Channel Inverting 3-Straight CMOS 20-Pin SOIC
U?#2 U?#6 U?#11 U?#14 U?#16 U?#21 U?#25 U?#30 U?#36 U?#39 U?#47 U?#50 U?#58 U?#61 U?#67 U?#70 U?#76 U?#79 U?#85 U?#88 = CMP-016-00014-1: 4-ch, 4-input 2-V to 6-V 5.2-mA drive strength AND gate with Schmitt-Trigger inputs 14-SOIC -40 to 85
U?#4 U?#8 U?#19 U?#28 U?#37 U?#48 U?#59 U?#68 U?#77 U?#86 = CMP-016-00013-1: Four-channel, two-input, 1.65V to 3.6V 24mA drive strength OR gate 14-TSSOP -40 to 125
U?#5 U?#40 U?#43 = CMP-0440-00699-3: Enhanced Product Octal Buffers/Drivers With 3-State Outputs, DW0020A, LARGE T&R; Generic Part Number: SN74ACT244-EP; Manufacturer: Texas Instruments; Rating: HiRel Enhanced Product; VCC(Max)(V): 5.5; Output Type: CMOS; ICC @ Nom Voltage(Max)(mA): 0.04; F @ Nom Voltage(Max)(Mhz): 90; tpd @ Nom Voltage(Max)(ns): 9; Voltage(Nom)(V): 5; Input Type: TTL; VCC(Min)(V): 4.5; PackageReference: DW0020A; Code_JEDEC: MS-013; DatasheetVersion: SCAS724B; Operating Temperature Range(C): -40 to 85; PackageVersion: http://www.ti.com/lit/ml/mpds173a/mpds173a.pdf
U?#13 U?#17 U?#18 U?#20 U?#22-U?#24 U?#26 U?#27 U?#29 U?#31-U?#35 U?#38 U?#41 U?#42 U?#44-U?#46 U?#49 U?#51 U?#52 U?#54 U?#56 U?#57 U?#60 U?#62-U?#66 U?#69 U?#71-U?#75 U?#78 U?#80-U?#84 U?#87 U?#89 U?#90 = CMP-1627-00163-3: IC GATE NAND 3CH 3-INP 14SOIC; Number of Input Lines: 3; Propagation Delay: 16ns; Max Supply Voltage: 6V; Min Supply Voltage: 2V; Number of Outputs: 1; Schmitt Trigger Input: No; Quiescent Current: 2uA; Output Current: 25mA; Low Level Output Current: 5.2mA; High Level Output Current: -5.2mA; Logic Function: NAND GATE; Turn-On Delay Time: 24ns; Operating Supply Voltage: 5V; Contact Plating: Gold; Number of Gates: 3; Packaging: Tape and Reel; Lead Free: Lead Free; Height: 1.58mm; Length: 8.65mm; Number of Inputs: 3; Number of Pins: 14; RoHS Compliant: Yes; Number of Bits: 3; Number of Circuits: 3; Min Operating Temperature: -40°C; Mount: Surface Mount; REACH SVHC: No SVHC; Radiation Hardening: No; Package Quantity: 1; Number of Output Lines: 1; Weight: 0.004564oz; Max Operating Temperature: 85°C; Number of Elements: 3; Case/Package: SOIC; Width: 3.91mm